# EAGLE design Telemetry Board new (EAGLE 7.6.0)
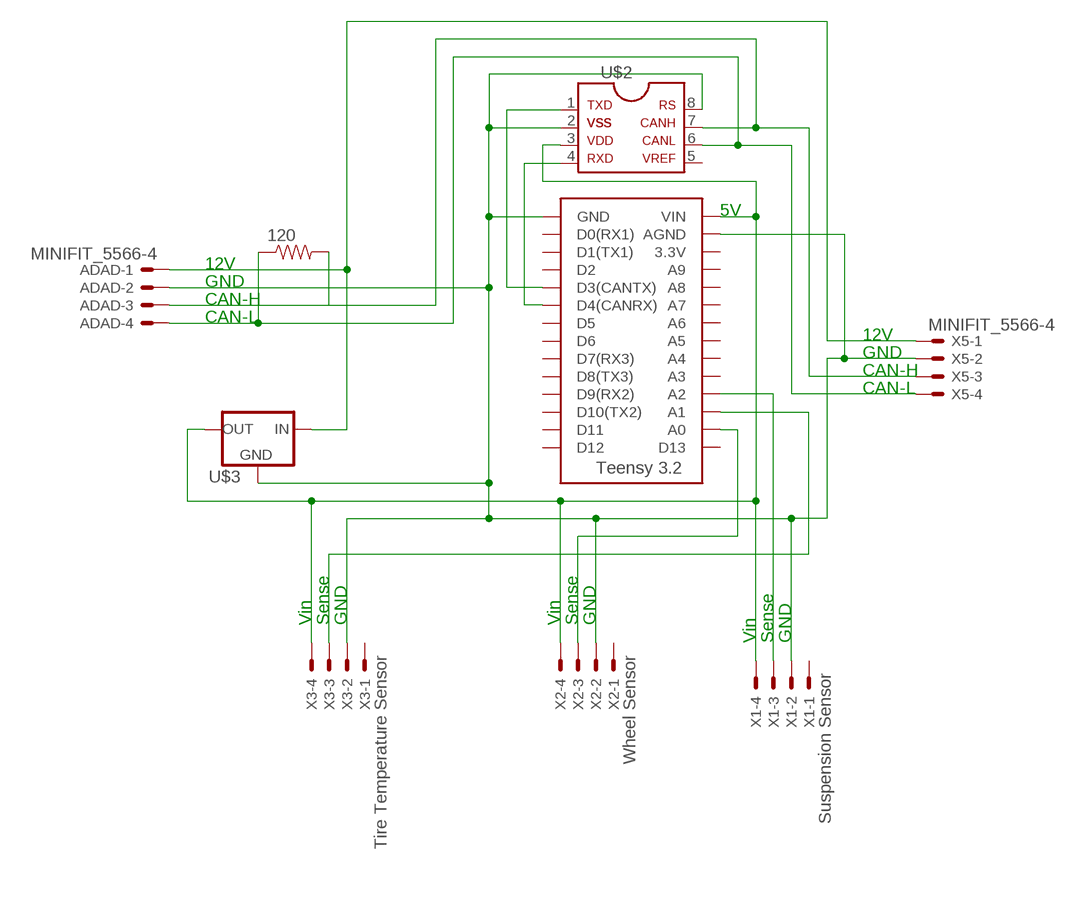
[diagram p0: schematic, sheet 1]

## Parts
120  RESISTOR0402  [0402-RES]
ADAD  MINIFIT_5566-4  [MINIFIT_5566-4]
U$1  TEENSY_3.2_SIMPLE  [TEENSY_3.2_SIMPLE]
U$2  MCP2551SOIC  [SOIC08]
U$3  5V_REGULATOR_LM340-NLM340MPX-5.0/NOPB  [SOT223]
X1  Suspension Sensor  MINIFIT_5566-4  [MINIFIT_5566-4]
X2  Wheel Sensor  MINIFIT_5566-4  [MINIFIT_5566-4]
X3  Tire Temperature Sensor  MINIFIT_5566-4  [MINIFIT_5566-4]
X5  MINIFIT_5566-4  [MINIFIT_5566-4]

## Nets
N$1: ADAD.1 U$3.1(IN) X5.1
N$3: 120.2 ADAD.3 U$2.7 X5.3
N$4: 120.1 ADAD.4 U$2.6 X5.4
N$6: ADAD.2 U$1.AGND U$1.GND U$2.2 U$2.8 U$3.2(GND) U$3.4(GND) X1.2 X2.2 X3.2 X5.2
N$9: U$1.D3(CANTX) U$2.1
N$10: U$1.D4(CANRX) U$2.4
N$12: U$1.A1 X3.3
N$13: U$1.VIN U$2.3 U$3.3(OUT) X1.4 X2.4 X3.4
N$16: U$1.A0 X2.3
N$19: U$1.A2 X1.3
Unconnected: U$1.3.3V U$1.A3 U$1.A4 U$1.A5 U$1.A6 U$1.A7 U$1.A8 U$1.A9 U$1.D0(RX1) U$1.D1(TX1) U$1.D2 U$1.D5 U$1.D6 U$1.D7(RX3) U$1.D8(TX3) U$1.D9(RX2) U$1.D10(TX2) U$1.D11 U$1.D12 U$1.D13 U$2.5 X1.1 X2.1 X3.1

## Notes on the sheet
- 5V
- 12V
- GND
- CAN-H
- CAN-L
- 12V
- GND
- CAN-H
- CAN-L
- Vin | Sense | GND | Vin | Sense | GND
- Vin | Sense | GND

## Library data of the parts
120 = HyTech:RESISTOR: Resistor Basic schematic elements and footprints for 0603, 1206, and PTH resistors.
ADAD X1-X3 X5 = HyTechDevices:MINIFIT_5566-4: Mini FIT Junior connector 4 pole Source: http://www.molex.com; OC_FARNELL: unknown; OC_NEWARK: unknown
U$1 = HyTechDevices:TEENSY_3.2_SIMPLE: Simple version of the Teensy 3.2 board that only uses the 2 main rows of pins, not the inner pins or the pins opposite the usb port.
U$2 = HyTechDevices:MCP2551: MCP2551 High-Speed CAN Transceiver Product Webpage <https://www.microchip.com/wwwproducts/en/MCP2551> Datasheet <http://ww1.microchip.com/downloads/en/DeviceDoc/21667f.pdf> This device is outdated It is replaced by MCP2561. Comparison Page <https://www.microchip.com/wwwproducts/ProductCompare/MCP2551/MCP2561> Product Webpage <https://www.microchip.com/wwwproducts/en/MCP2561> Datasheet <http://ww1.microchip.com/downloads/en/DeviceDoc/20005167C.pdf>
U$3 = HyTechDevices:5V_REGULATOR_LM340-N: Voltage Regulator 5v linear voltage regulator Datasheet <http://www.mouser.com/ProductDetail/Texas-Instruments/LM340MPX-50-NOPB/?qs=X1J7HmVL2ZGZwtTFRQ9ItA%3D%3D> MAX current out: 1.5A MAX voltage in: 35V

## Board
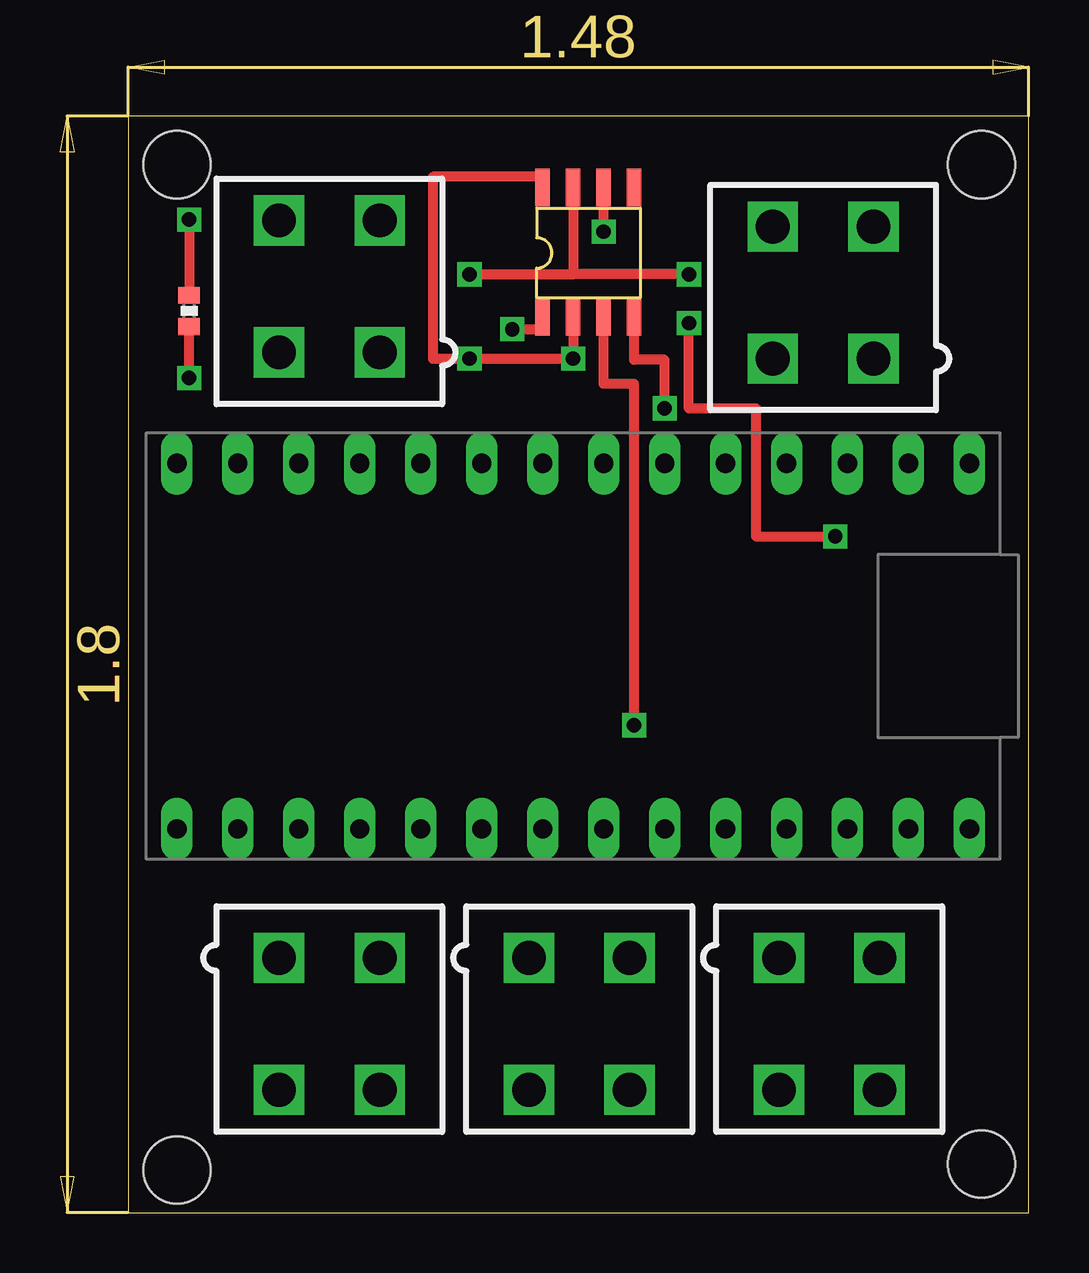
[diagram p1: board, top side]
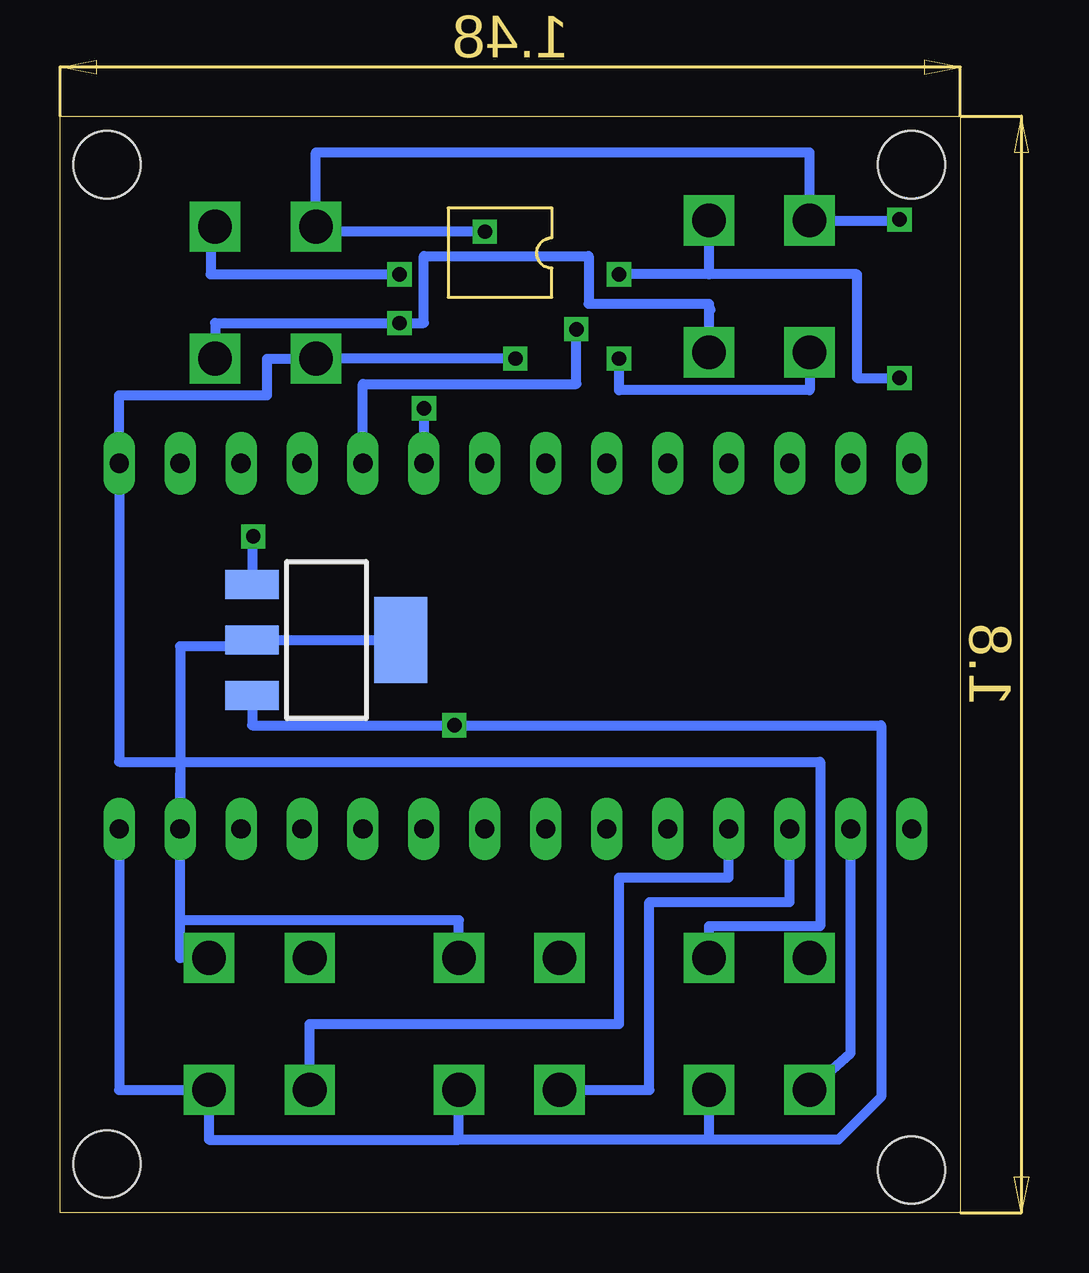
[diagram p2: board, bottom side, seen from below]

Size 37.52 x 45.71 mm. Coordinates in mm from the lower left corner, seen from the top.
Outline: 0,0 37.52,0 37.52,45.71 0,45.71 0,0
Copper layers (1*16): Top 0.035mm / dielectric 1.5mm / Bottom 0.035mm
Design rules "default": minimum track width 10mil, minimum drill 24mil, track to track 8mil, track to pad 8mil, pad to pad 8mil, via to via 8mil, smd to smd 8mil, copper to edge 40mil, drill to drill 8mil, minimum pad ring 10mil, minimum via ring 8mil, stop-mask expansion 4mil, vias tented up to drill 0mil, thermal gap 10mil
Holes 2.8 mm at 2.03,43.69 2.03,1.78 35.56,43.69 35.56,2.03

### Footprints (pad centres in the part's own frame; a part is rotated, then mirrored left to right if it is on the bottom)
0402-RES = smd 0.7 x 0.9: 1 -0.65,0; 2 0.65,0
MINIFIT_5566-4 = drill 1.4 square: 1 2.1,-2.75; 2 -2.1,-2.75; 3 2.1,2.75; 4 -2.1,2.75
TEENSY_3.2_SIMPLE = drill 0.8 long: 3.3V 16.51,29.21; A0 16.51,3.81; A1 16.51,6.35; A2 16.51,8.89; A3 16.51,11.43; A4 16.51,13.97; A5 16.51,16.51; A6 16.51,19.05; A7 16.51,21.59; A8 16.51,24.13; A9 16.51,26.67; AGND 16.51,31.75; D0(RX1) 1.27,31.75; D1(TX1) 1.27,29.21; D2 1.27,26.67; D3(CANTX) 1.27,24.13; D4(CANRX) 1.27,21.59; D5 1.27,19.05; D6 1.27,16.51; D7(RX3) 1.27,13.97; D8(TX3) 1.27,11.43; D9(RX2) 1.27,8.89; D10(TX2) 1.27,6.35; D11 1.27,3.81; D12 1.27,1.27; D13 16.51,1.27; GND 1.27,34.29; VIN 16.51,34.29
SOIC08 = smd 0.6 x 1.55: 1 0,0; 2 1.27,0; 3 2.54,0; 4 3.81,0; 5 3.81,5.4; 6 2.54,5.4; 7 1.27,5.4; 8 0,5.4
SOT223 = smd 1.219 x 2.235: 1 -2.311,-3.099; 2 0,-3.099; 3 2.311,-3.099 | smd 3.6 x 2.2: 4 0,3.099

### Placement (x,y rotation side)
120  2.54,37.59 270 top
ADAD  8.38,38.61 0 top
U$1  0.76,32.51 270 top
U$2  17.27,37.34 0 top
U$3  26.42,23.88 270 bottom
X1  29.21,7.87 180 top
X2  8.38,7.87 180 top
X3  18.8,7.87 180 top
X5  28.96,38.35 0 top

### Tracks (layer width: path | path; a pad name or v marks a point on that pad's centre or on a via)
N$1  (via drill 0.6)
  Top 0.406: v23.37,37.08 23.37,33.53 26.16,33.53 26.16,28.19 v29.46,28.19
  Bottom 0.406: 10.48,37.89 15.49,37.89 15.49,39.88 22.35,39.88 22.35,37.08 v23.37,37.08 31.06,37.08 X5.1 | 10.41,37.64 10.48,37.89 | 10.48,37.89 ADAD.1 | v29.46,28.19 29.52,28.19 U$3.1
N$3  (via drill 0.6)
  Top 0.406: U$2.7 18.54,39.12 | v14.22,39.12 18.54,39.12 | v23.37,39.12 18.54,39.12 | v2.54,34.8 120.2
  Bottom 0.406: v23.37,39.12 31.24,39.12 31.24,41.1 X5.3 | v2.54,34.8 4.32,34.8 4.32,39.12 10.48,39.12 | 10.48,39.12 v14.22,39.12 | ADAD.3 10.48,39.12
N$4  (via drill 0.6)
  Top 0.406: v2.54,41.4 120.1 | v19.81,40.89 U$2.6
  Bottom 0.406: v19.81,40.89 26.86,40.89 X5.4 26.86,44.2 6.28,44.2 ADAD.4 2.54,41.36 v2.54,41.4
N$6  (via drill 0.6)
  Top 0.406: U$2.8 17.27,43.18 12.7,43.18 12.7,35.6 v14.22,35.6 v18.54,35.6 U$2.2
  Bottom 0.406: U$3.4 U$3.2 29.52,23.62 32.51,23.62 32.51,18.8 | v18.54,35.6 X5.2 28.89,35.6 28.89,34.08 35.05,34.08 U$1.GND 35.05,18.8 32.51,18.8 | ADAD.2 6.28,34.29 14.22,34.29 v14.22,35.6 | 32.51,18.8 U$1.AGND | U$1.AGND 32.51,18.29 | 32.51,18.8 5.84,18.8 5.84,11.94 10.48,11.94 X2.2 | X1.2 32.51,10.62 32.51,12.19 | 32.51,12.19 U$1.AGND | X3.2 20.9,12.19 32.51,12.19
N$9  (via drill 0.6)
  Top 0.406: v16,36.83 17.27,36.83 U$2.1
  Bottom 0.406: U$1.D3(CANTX) 24.89,34.54 16,34.54 v16,36.83
N$10  (via drill 0.6)
  Top 0.406: v22.35,33.53 22.35,35.56 21.08,35.56 U$2.4
  Bottom 0.406: v22.35,33.53 U$1.D4(CANRX)
N$12
  Bottom 0.406: X3.3 12.95,5.12 12.95,12.95 7.11,12.95 U$1.A1
N$13  (via drill 0.6)
  Top 0.406: v21.08,20.32 21.08,34.54 19.81,34.54 U$2.3
  Bottom 0.406: U$3.3 29.52,20.32 v21.08,20.32 3.3,20.32 3.3,4.83 5.08,3.05 10.48,3.05 | U$1.VIN 35.05,5.12 X1.4 31.31,3.05 20.9,3.05 | 20.9,3.05 X3.4 | X2.4 10.48,3.05 | 10.48,3.05 20.9,3.05
N$16
  Bottom 0.406: X2.3 4.57,6.65 U$1.A0
N$19
  Bottom 0.406: X1.3 27.11,7.87 14.22,7.87 14.22,13.97 9.65,13.97 U$1.A2